# EAGLE design ded_pribor01 (EAGLE 5.00)
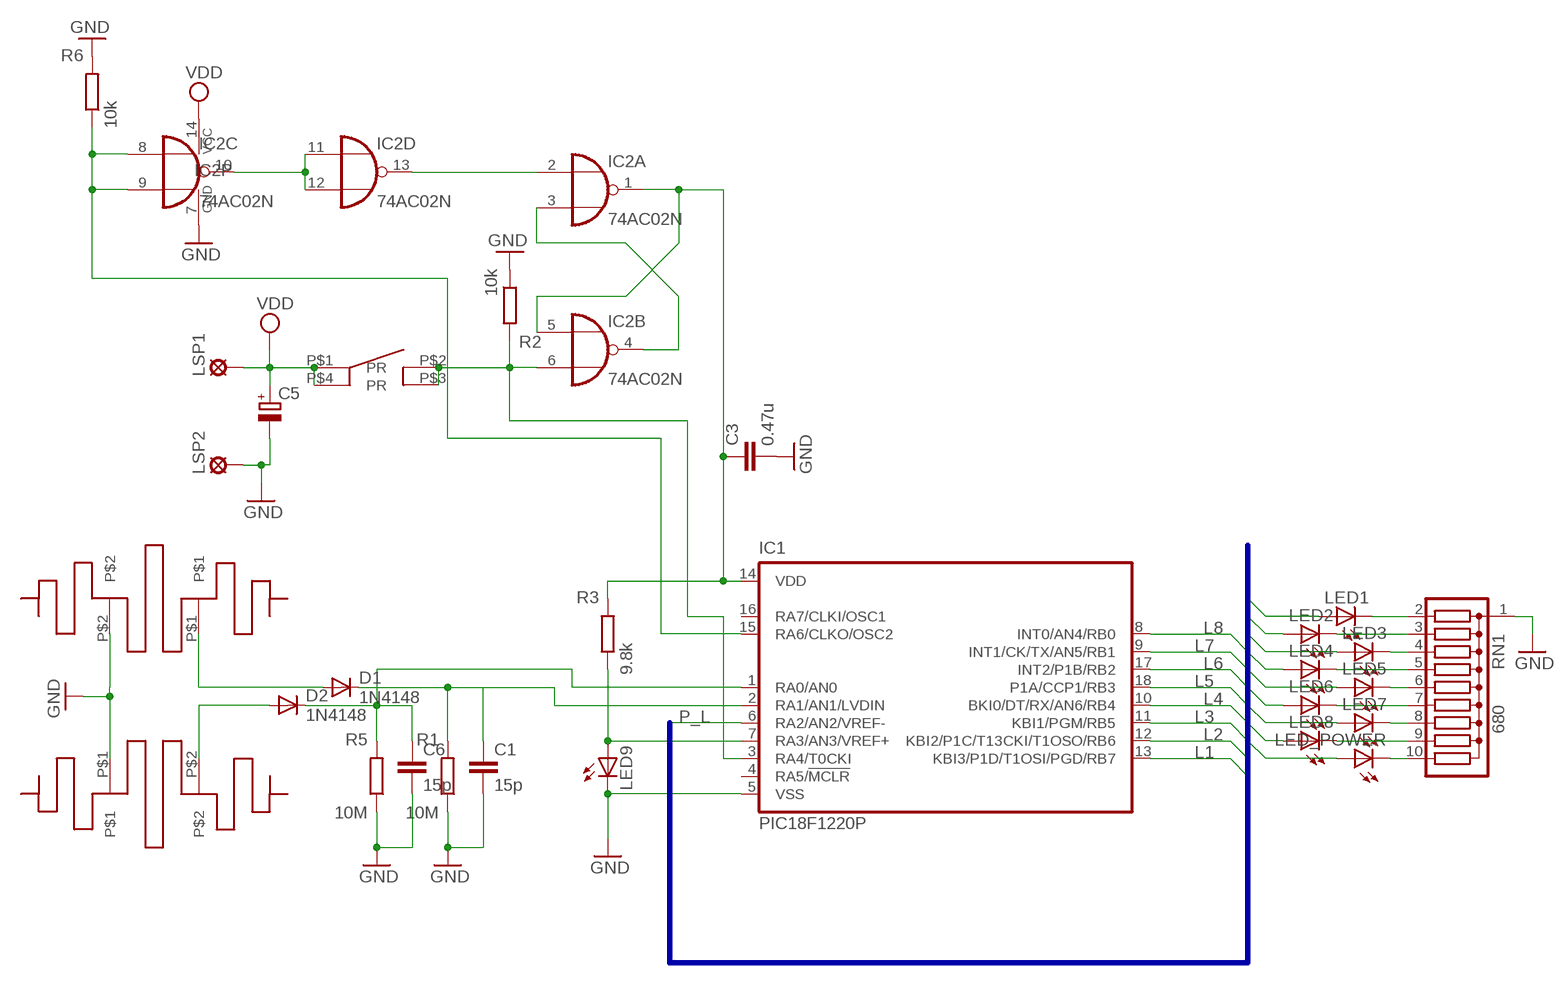
[diagram p0: schematic, sheet 1]

## Parts
C1  15p  C-EUC1206  [C1206]
C3  0.47u  C-EUC1206  [C1206]
C5  CPOL-EUSMCA  [SMC_A]
C6  15p  C-EUC1206  [C1206]
D1  1N4148  [DO35-10]
D2  1N4148  [DO35-10]
IC1  PIC18F1220P  [DIL18]
IC2  74AC02N  [DIL14]
LED1  LED3MM  [LED3MM]
LED2  LED3MM  [LED3MM]
LED3  LED3MM  [LED3MM]
LED4  LED3MM  [LED3MM]
LED5  LED3MM  [LED3MM]
LED6  LED3MM  [LED3MM]
LED7  LED3MM  [LED3MM]
LED8  LED3MM  [LED3MM]
LED9  LED5MM  [LED5MM]
LED_POWER  LED3MM  [LED3MM]
LSP1  SE14  [SE14]
LSP2  SE14  [SE14]
R1  10M  R-EU_M1206  [M1206]
R2  10k  R-EU_M1206  [M1206]
R3  9.8k  R-EU_M1206  [M1206]
R5  10M  R-EU_M1206  [M1206]
R6  10k  R-EU_M1206  [M1206]
RN1  680  G09R  [SIL10]
U$1  TIKBUTTON01  [TIKBUTTON01]
U$2  ANTENNA  [ANT!]
U$3  ANTENNA  [ANT!]

## Nets
GND [my_def]: C1.2 C3.2 C5.- C6.2 IC1.5(VSS) IC2.7(P:GND) LED9.K(C) LSP2.MP R1.1 R2.1 R5.1 R6.2 RN1.1 U$2.P$1 U$3.P$2
L1: IC1.13(KBI3/P1D/T1OSI/PGD/RB7) LED1.A
L2: IC1.12(KBI2/P1C/T13CKI/T1OSO/RB6) LED2.A
L3: IC1.11(KBI1/PGM/RB5) LED3.A
L4: IC1.10(BKI0/DT/RX/AN6/RB4) LED4.A
L5: IC1.18(P1A/CCP1/RB3) LED5.A
L6: IC1.17(INT2/P1B/RB2) LED6.A
L7: IC1.9(INT1/CK/TX/AN5/RB1) LED7.A
L8: IC1.8(INT0/AN4/RB0) LED8.A
N$1: C1.1 D1.C IC1.2(RA1/AN1/LVDIN) R1.2
N$2 [my_def]: C6.1 D2.C IC1.1(RA0/AN0) R5.2
N$3: LED1.K(C) RN1.2
N$4: LED2.K(C) RN1.3
N$5: LED3.K(C) RN1.4
N$6: LED4.K(C) RN1.5
N$7: LED5.K(C) RN1.6
N$8: LED6.K(C) RN1.7
N$9: LED7.K(C) RN1.8
N$10: LED8.K(C) RN1.9
N$11: LED_POWER.K(C) RN1.10
N$12: C3.1 IC1.14(VDD) IC2.1(A:O) IC2.5(B:I0) R3.2
N$13: IC2.3(A:I1) IC2.4(B:O)
N$14: D1.A U$3.P$1
N$15: IC2.2(A:I0) IC2.13(D:O)
N$16: IC1.3(RA4/T0CKI) IC2.6(B:I1) R2.2 U$1.P$2(R) U$1.P$3(R)
N$17: D2.A U$2.P$2
N$18: IC1.7(RA3/AN3/VREF+) LED9.A R3.1
N$22: IC2.10(C:O) IC2.11(D:I0) IC2.12(D:I1)
N$23: IC1.15(RA6/CLKO/OSC2) IC2.8(C:I0) IC2.9(C:I1) R6.1
P_L: IC1.6(RA2/AN2/VREF-) LED_POWER.A
VDD [my_def]: C5.+ IC2.14(P:VCC) LSP1.MP U$1.P$1(P) U$1.P$4(P)
Unconnected: IC1.4(RA5/!MCLR) IC1.16(RA7/CLKI/OSC1)

## Buses
L1,L2,L3,L4,L5,L6,L7,L8,P_L

## Library data of the parts
C1 C3 C6 = rcl:C-EU: CAPACITOR, European symbol
C5 = rcl:CPOL-EU: POLARIZED CAPACITOR, European symbol
D1 D2 = diode:1N4148: DIODE high speed (Philips)
IC1 = microchip:PIC18F1*20: 18/20/28-Pin High-Performance, Enhanced Flash Microcontrollers with 10-bit A/D and nanoWatt Technology Source: ww1.microchip.com/downloads/en/DeviceDoc/39605c.pdf
IC2 = 74xx-eu:74*02: Quad 2-input NOR gate
LED1-LED9 LED_POWER = led:LED: LED OSRAM: - CHIPLED LG R971, LG N971, LY N971, LG Q971, LY Q971, LO R971, LY R971 LH N974, LH R974 LS Q976, LO Q976, LY Q976 LO Q996 - Hyper CHIPLED LW Q18S LB Q993, LB Q99A, LB R99A - SideLED LS A670, LO A670, LY A670, LG A670, LP A670 LB A673, LV A673, LT A673, LW A673 LH A674 LY A675 LS A676, LA A676, LO A676, LY A676, LW A676 LS A679, LY A679, LG A679 - Hyper Micro SIDELED® LS Y876, LA Y876, LO Y876, LY Y876 LT Y87S - SmartLED LW L88C, LW L88S LB L89C, LB L89S, LG L890 LS L89K, LO L89K, LY L89K LS L896, LA L896, LO L896, LY L896 - TOPLED LS T670, LO T670, LY T670, LG T670, LP T670 LSG T670, LSP T670, LSY T670, LOP T670, LYG T670 LG T671, LOG T671, LSG T671 LB T673, LV T673, LT T673, LW T673 LH T674 LS T676, LA T676, LO T676, LY T676, LB T676, LH T676, LSB T676, LW T676 LB T67C, LV T67C, LT T67C, LS T67K, LO T67K, LY T67K, LW E67C LS E67B, LA E67B, LO E67B, LY E67B, LB E67C, LV E67C, LT E67C LW T67C LS T679, LY T679, LG T679 LS T770, LO T770, LY T770, LG T770, LP T770 LB T773, LV T773, LT T773, LW T773 LH T774 LS E675, LA E675, LY E675, LS T675 LS T776, LA T776, LO T776, LY T776, LB T776 LHGB T686 LT T68C, LB T68C - Hyper Mini TOPLED® LB M676 - Mini TOPLED Santana® LG M470 LS M47K, LO M47K, LY M47K Source: http://www.osram.convergy.de - LUMILED® LXK2-PW12-R00, LXK2-PW12-S00, LXK2-PW14-U00, LXK2-PW14-V00 LXK2-PM12-R00, LXK2-PM12-S00, LXK2-PM14-U00 LXK2-PE12-Q00, LXK2-PE12-R00, LXK2-PE12-S00, LXK2-PE14-T00, LXK2-PE14-U00 LXK2-PB12-K00, LXK2-PB12-L00, LXK2-PB12-M00, LXK2-PB14-N00, LXK2-PB14-P00, LXK2-PB14-Q00 LXK2-PR12-L00, LXK2-PR12-M00, LXK2-PR14-Q00, LXK2-PR14-R00 LXK2-PD12-Q00, LXK2-PD12-R00, LXK2-PD12-S00 LXK2-PH12-R00, LXK2-PH12-S00 LXK2-PL12-P00, LXK2-PL12-Q00, LXK2-PL12-R00 Source: www.luxeon.com
LSP1 LSP2 = solpad:SE14: SOLDER PAD E1553, drill 1,4mm, distributor Buerklin, 07F820
R1-R3 R5 R6 = rcl:R-EU_: RESISTOR, European symbol
RN1 = resistor-sil:G09R: SIL RESISTOR
U$1 = buttons:TIKBUTTON01: button tik
U$2 U$3 = antenna:ANTENNA: ANTENNA ded

## Net classes
2 net12: width 0.305 mm
3 my_def: width 0.508 mm

## Board
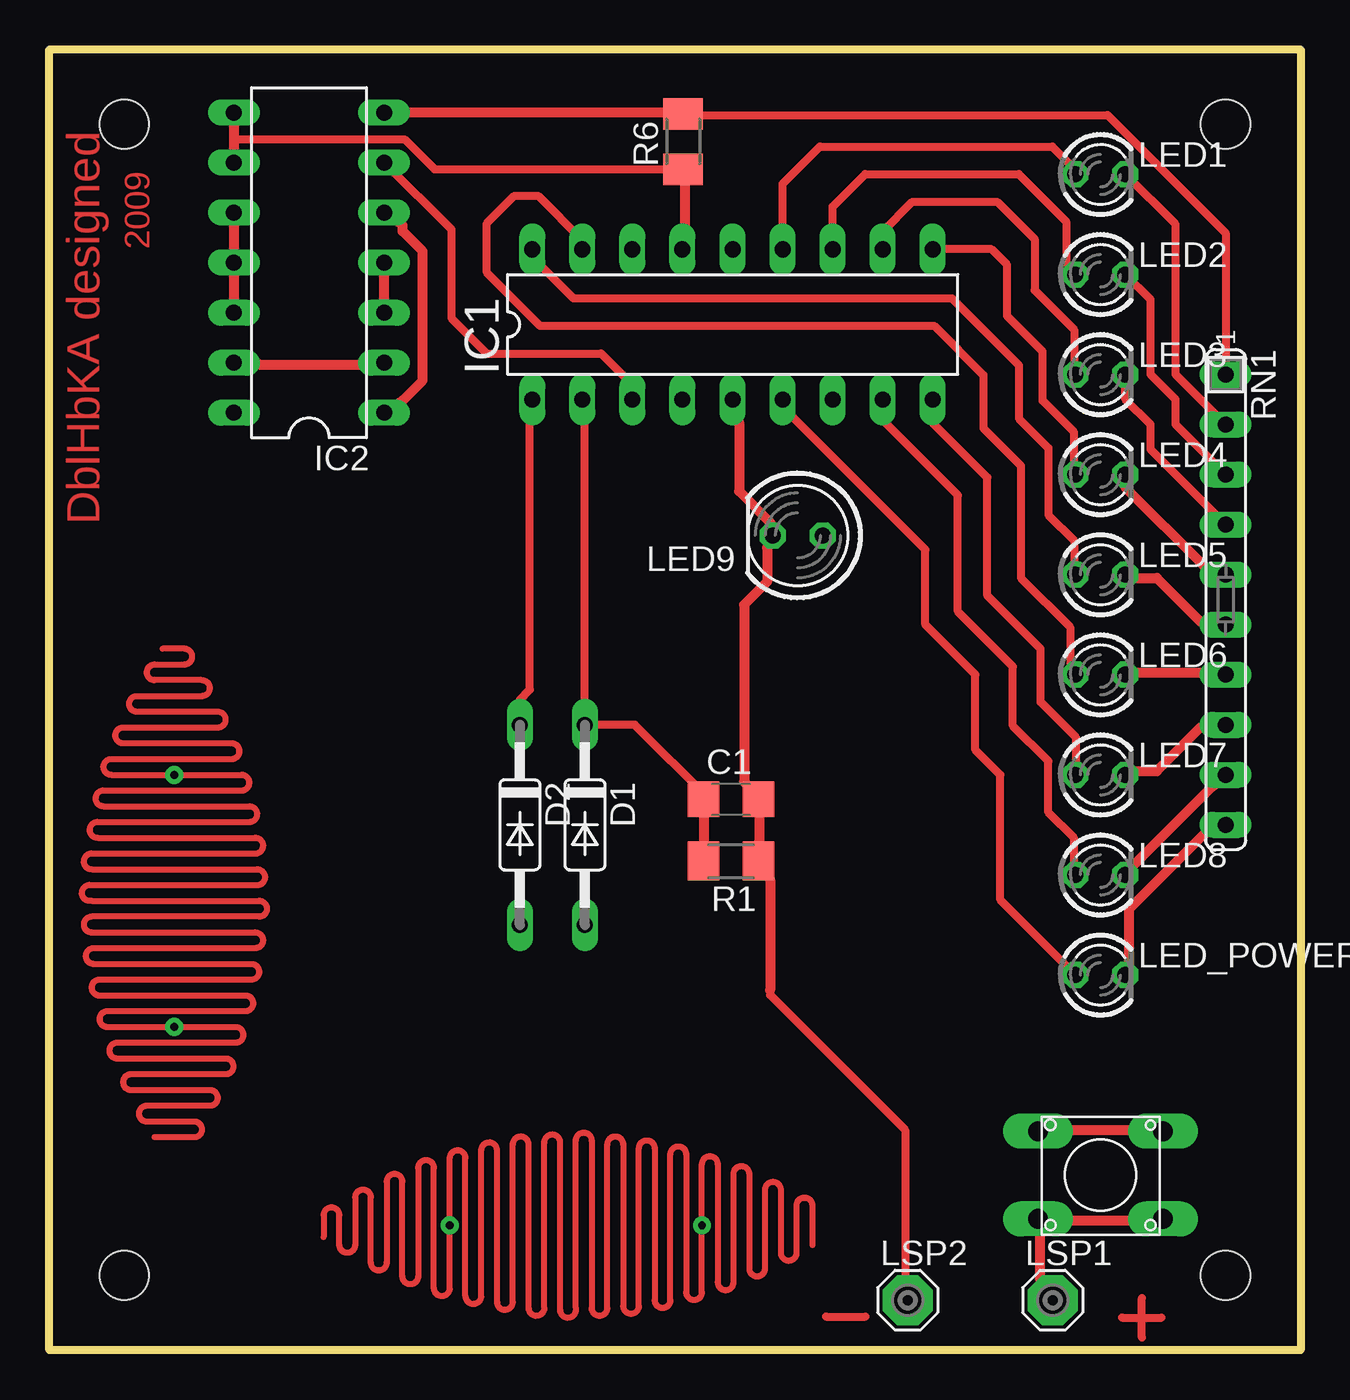
[diagram p1: board, top side]
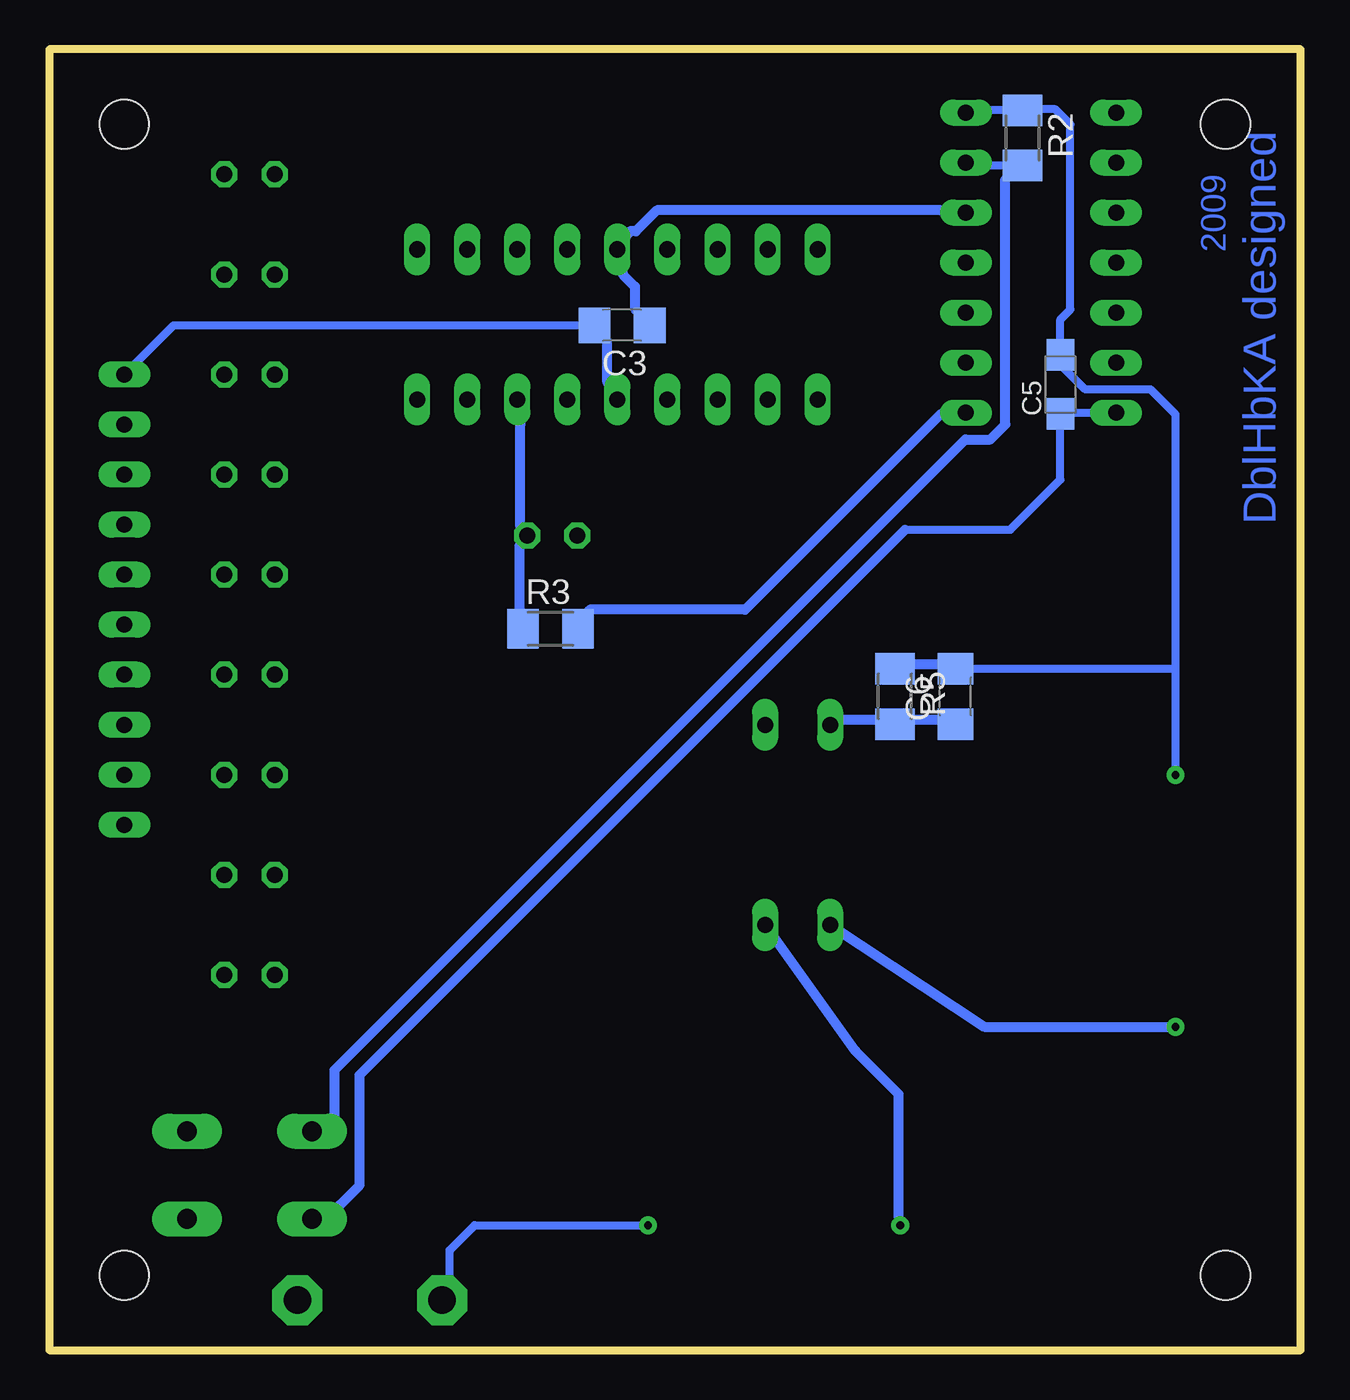
[diagram p2: board, bottom side, seen from below]

Size 63.5 x 66.04 mm. Coordinates in mm from the lower left corner, seen from the top.
Outline: 0,0 0,66.04 63.5,66.04 63.5,0 0,0
Copper layers (1*16): Top 0.035mm / dielectric 1.5mm / Bottom 0.035mm
Design rules "default *": minimum track width 20mil, minimum drill 24mil, track to track 20mil, track to pad 15mil, pad to pad 8mil, via to via 8mil, smd to smd 8mil, copper to edge 40mil, drill to drill 8mil, minimum pad ring 10mil, minimum via ring 8mil, stop-mask expansion 4mil, vias tented up to drill 0mil, thermal gap 10mil
Holes 2.5 mm at 3.81,3.81 3.81,62.23 59.69,3.81 59.69,62.23

### Footprints (pad centres in the part's own frame; a part is rotated, then mirrored left to right if it is on the bottom)
C1206 = smd 1.6 x 1.8: 1 -1.4,0; 2 1.4,0
SMC_A = smd 1.6 x 1.4: + -1.5,0; - 1.5,0
DO35-10 = drill 0.813 long: A 5.08,0; C -5.08,0
DIL18 = drill 0.813 long: 1 -10.16,-3.81; 2 -7.62,-3.81; 3 -5.08,-3.81; 4 -2.54,-3.81; 5 0,-3.81; 6 2.54,-3.81; 7 5.08,-3.81; 8 7.62,-3.81; 9 10.16,-3.81; 10 10.16,3.81; 11 7.62,3.81; 12 5.08,3.81; 13 2.54,3.81; 14 0,3.81; 15 -2.54,3.81; 16 -5.08,3.81; 17 -7.62,3.81; 18 -10.16,3.81
DIL14 = drill 0.813 long: 1 -7.62,-3.81; 2 -5.08,-3.81; 3 -2.54,-3.81; 4 0,-3.81; 5 2.54,-3.81; 6 5.08,-3.81; 7 7.62,-3.81; 8 7.62,3.81; 9 5.08,3.81; 10 2.54,3.81; 11 0,3.81; 12 -2.54,3.81; 13 -5.08,3.81; 14 -7.62,3.81
LED3MM = drill 0.813 octagon: A -1.27,0; K 1.27,0
LED5MM = drill 0.813 octagon: A -1.27,0; K 1.27,0
SE14 = drill 1.397 pad 2.54 octagon: MP 0,0
M1206 = smd 1.6 x 2: 1 -1.4,0; 2 1.4,0
SIL10 = drill 0.813 long: 1 -11.43,0; 2 -8.89,0; 3 -6.35,0; 4 -3.81,0; 5 -1.27,0; 6 1.27,0; 7 3.81,0; 8 6.35,0; 9 8.89,0; 10 11.43,0
TIKBUTTON01 = drill 1 pad 1.778 long: P$1 -2.223,-3.175; P$2 2.223,-3.175; P$3 2.223,3.175; P$4 -2.223,3.175
ANT! = drill 0.4 pad 0.8 round: P$1 0,0; P$2 12.8,0

### Placement (x,y rotation side)
C1  34.6,27.98 0 top
C3  34.43,52.03 180 bottom
C5  12.19,49.02 90 bottom
C6  17.53,33.19 90 bottom
D1  27.18,26.67 270 top
D2  23.88,26.67 270 top
IC1  34.67,52.07 0 top
IC2  13.18,55.21 90 top
LED1  53.34,59.69 0 top
LED2  53.34,54.61 0 top
LED3  53.34,49.53 0 top
LED4  53.34,44.45 0 top
LED5  53.34,39.37 0 top
LED6  53.34,34.29 0 top
LED7  53.34,29.21 0 top
LED8  53.34,24.13 0 top
LED9  37.98,41.36 180 top
LED_POWER  53.34,19.05 0 top
LSP1  50.91,2.54 0 top
LSP2  43.56,2.54 0 top
R1  34.6,24.84 180 top
R2  14.11,61.53 270 bottom
R3  38.06,36.61 0 bottom
R5  20.59,33.19 270 bottom
R6  32.16,61.35 90 top
RN1  59.69,38.1 270 top
U$1  53.34,8.89 90 top
U$2  6.35,29.21 270 top
U$3  20.32,6.35 0 top

### Tracks (layer width: path | path; a pad name or v marks a point on that pad's centre or on a via)
GND
  Top 0.406: RN1.1 59.69,56.71 53.7,62.7 32,62.7 32.05,62.75 R6.2 | 36.58,18.29 36.58,18.03 43.43,11.18 43.43,2.79 43.56,2.67 LSP2.MP
  Top 0.508: IC1.5 35,47 35,43.6 36.6,42 LED9.K 36.42,40.74 36.42,39.01 35.26,37.85 35.26,28.85 C1.2 36.02,27.13 36.02,25.81 R1.1 36.58,23.88 36.58,18.29 | IC2.7 18.29,62.84 31.19,62.84 R6.2
  Bottom 0.406: C3.2 57.19,52.03 RN1.1 | 16.99,62.96 17.02,62.99 | 16.99,62.96 IC2.7 | 16.99,62.96 16.96,62.93 R2.1 14.17,62.93 14.22,62.99 12.45,62.99 11.68,62.23 11.68,52.83 12.19,52.32 C5.- 12.19,50.04 10.92,48.77 7.62,48.77 6.35,47.5 6.35,34.54 | U$2.P$1 6.35,34.54 | C6.2 6.39,34.59 6.35,34.54 | U$3.P$2 41.91,6.35 43.18,5.08 43.18,2.54 LSP2.MP
  Bottom 0.508: C3.2 35.2,51.2 35.2,49.2 IC1.5 | R5.1 19.81,34.8 18.29,34.8 C6.2
L1
  Top 0.406: IC1.13 37.21,59.21 39.1,61.1 50.9,61.1 52.3,59.7 52.29,59.69 LED1.A
L2
  Top 0.406: IC1.12 39.75,58.05 41.4,59.7 49.2,59.7 51.6,57.3 51.6,55.2 52.1,54.7 52.07,54.67 LED2.A
L3
  Top 0.406: 52.2,49.4 LED3.A 52.17,49.53 | IC1.11 42.29,56.79 43.8,58.3 48.1,58.3 50,56.4 50,53.8 52,51.8 52,49.7 52.17,49.53 | 52.17,49.53 52.2,49.5
L4
  Top 0.406: IC1.10 47.82,55.88 48.6,55.1 48.6,52.5 50.4,50.7 50.4,48.2 52,46.6 52,44.3 52.07,44.37 LED4.A
L5
  Top 0.406: IC1.18 24.51,55.49 26.6,53.4 45.8,53.4 49.2,50 49.2,47.3 50.7,45.8 50.7,42.4 52,41.1 52,39.3 52.07,39.23 | 52.07,39.23 52.1,39.2 | 52.07,39.23 LED5.A
L6
  Top 0.406: IC1.17 27.05,56.35 24.8,58.6 23.6,58.6 22.2,57.2 22.2,54.7 24.9,52 44.9,52 47.4,49.5 47.4,46.8 49.3,44.9 49.3,39.2 51.8,36.7 51.8,34.6 52.1,34.3 52.09,34.29 LED6.A
L7
  Top 0.406: IC1.9 44.83,47.07 47.6,44.3 47.6,38.3 50.3,35.6 50.3,32.9 52.1,31.1 52.1,29.4 52,29.3 52.07,29.23 LED7.A
L8
  Top 0.406: IC1.8 42.29,47.21 46.1,43.4 46.1,37.5 48.9,34.7 48.9,31.7 50.7,29.9 50.7,27.3 52,26 52,24 52.07,24.07 LED8.A
N$1
  Top 0.406: IC1.2 27.05,48.39 27.18,48.51 D1.C 29.72,31.75 33.49,27.98 | 33.49,27.98 33.53,27.94 | C1.1 33.49,27.98
  Top 0.508: R1.2 33.22,25.81 33.22,27.13 C1.1
N$2
  Top 0.406: D2.C 23.88,33.02 24.38,33.53 24.38,48.01 24.64,48.26 IC1.1
  Bottom 0.508: C6.1 18.29,32 19.81,32 R5.2 21.34,32 23.37,32 D2.C
N$3
  Top 0.406: LED1.K 57.15,57.15 57.15,49.53 RN1.2
N$4
  Top 0.406: LED2.K 55.88,53.34 55.88,49.53 57.15,48.26 57.15,46.99 RN1.3
N$5
  Top 0.406: LED3.K 54.61,48.26 55.88,46.99 55.88,45.72 RN1.4
N$6
  Top 0.508: RN1.5 58.6,39.8 54.6,43.8 LED4.K
N$7
  Top 0.508: LED5.K 55.2,39.2 56.2,39.2 58.4,37 RN1.6
N$8
  Top 0.508: LED6.K 55.2,34.4 58.4,34.4 RN1.7
N$9
  Top 0.508: LED7.K 55.2,29.4 56.2,29.4 58.4,31.6 RN1.8
N$10
  Top 0.508: LED8.K 55,24.6 59,28.6 RN1.9
N$11
  Top 0.508: LED_POWER.K 54.8,19.6 54.8,22.4 58.6,26.2 RN1.10
N$12
  Top 0.508: IC2.5 17.93,57.1 17.93,56.79 18.95,55.78 18.95,49.23 17.93,48.21 IC2.1
  Bottom 0.508: C3.1 33.78,52.88 33.78,54 34.39,54.61 IC1.14 34.04,56.79 33.73,56.79 32.66,57.86 18.29,57.86 IC2.5 | R3.2 36.07,37.59 28.19,37.59 18.29,47.5 IC2.1
N$13
  Top 0.508: IC2.3 17,53.2 17,54.6 IC2.4
N$14
  Bottom 0.508: U$3.P$1 20.4,6.8 20.4,13 22.6,15.2 D1.A
N$15
  Top 0.508: IC2.13 10.67,50.04 15.75,50.04 IC2.2
N$16
  Top 0.406: IC1.3 29.59,49.01 28,50.6 22.2,50.6 20.4,52.4 20.4,56.9 17.01,60.29 IC2.6
  Top 0.508: U$1.P$3 51.82,11.18 54.86,11.18 U$1.P$2
  Bottom 0.406: 16.99,60.42 17.02,60.45 | 16.99,60.42 IC2.6 | R2.2 16.7,60.13 16.99,60.42
  Bottom 0.508: U$1.P$3 49.02,11.94 49.02,14.22 17.02,46.23 15.75,46.23 14.99,46.99 14.99,59.44 R2.2
N$17
  Bottom 0.508: U$2.P$2 6.8,16.4 16,16.4 D2.A
N$18
  Bottom 0.508: IC1.7 39.6,47 39.6,41.8 LED9.A 39.62,40.89 39.62,37.59 R3.1
N$19
  Top 0.406: 39.43,1.7 41.41,1.7
N$20
  Top 0.406: 54.44,1.65 56.44,1.65
N$21
  Top 0.406: 55.44,0.65 55.44,2.65
N$22
  Top 0.508: IC2.12 9.4,53.09 9.4,54.61 IC2.11 9.4,55.63 9.4,57.15 IC2.10
N$23
  Top 0.406: R6.1 19.55,59.95 18.03,61.47 9.4,61.47
  Top 0.508: IC2.9 9.4,60.71 9.4,61.47 9.4,62.23 IC2.8 | IC1.15 32.26,57.15 32.26,59.18 R6.1
P_L
  Top 0.406: IC1.6 37.21,47.88 44.45,40.64 44.45,36.83 46.99,34.29 46.99,30.48 48.26,29.21 48.26,22.86 LED_POWER.A
VDD
  Top 0.508: LSP1.MP 50.29,3.56 50.29,5.84 U$1.P$4 51.82,6.6 54.86,6.6 U$1.P$1
  Bottom 0.406: 12.42,47.52 12.45,47.5 | 12.42,47.52 C5.+ 12.19,44.2 14.73,41.66 20.07,41.66 | IC2.14 12.35,47.59 12.42,47.52
  Bottom 0.508: 20.07,41.66 47.75,13.97 47.75,8.38 48.77,7.37 U$1.P$4

### Text on the board
Top: 2009 | DblHbKA designed
Bottom: 2009 | DblHbKA designed